# Altium project 9-10-00224-1_REV02_062018.PrjPcb
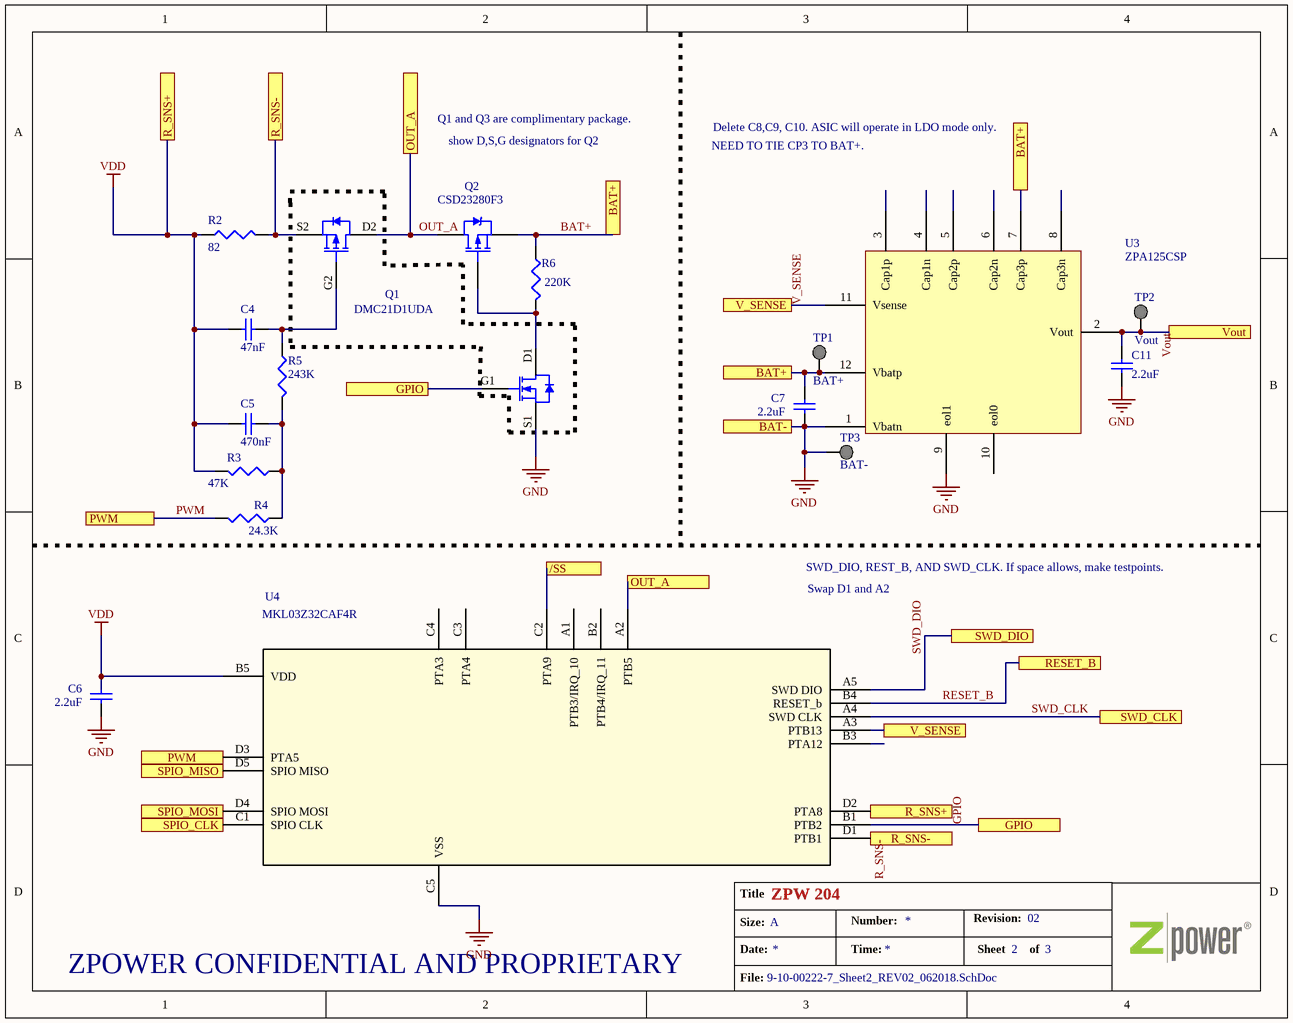
[diagram p0: 9-10-00222-7_Sheet2_REV02_062018.SchDoc]
2 sheets, 17 parts. Net scope: flat (ports and power ports of the same name join across sheets).
Board file: 9-10-00203-3_REV02_062018.PcbDoc
Sheets:
  9-10-00222-7_Sheet2_REV02_062018.SchDoc
  9-10-00222-7_Sheet3_REV02_062018.SchDoc

## Sheet 9-10-00222-7_Sheet2_REV02_062018.SchDoc: ZPW 204
size A; Revision: 02; SheetNumber: 2; SheetTotal: 3

### Parts
C4  47nF  [CAPC0603X03L(0201)]
C5  470nF  [CAPC0603X03L(0201)]
C6  2.2uF  [CAPC0603X03L(0201)]
C7  2.2uF  [CAPC0603X03L(0201)]
C11  2.2uF  [CAPC0603X03L(0201)]
Q1  DMC21D1UDA  [DMC21D1UDA]
Q2  CSD23280F3  [CSD23280F3]
R2  82  [RES0603X03L(0201)]
R3  47K  [RES0603X03L(0201)]
R4  24.3K  [RES0603X03L(0201)]
R5  243K  [RES0603X03L(0201)]
R6  220K  [RES0603X03L(0201)]
TP1  BAT+  [PAD 1.5MM X 0.5MM]
TP2  Vout  [PAD 1.5MM X 0.5MM]
TP3  BAT-  [BAT-]
U3  ZPA125CSP  [BGA12C30P4X4_138X138X38]
U4  MKL03Z32CAF4R  [MKL03Z32CBF4R]

### Ports
/SS, BAT+, BAT-, GPIO, OUT_A, PWM, R_SNS+, R_SNS-, RESET_B, SPIO_CLK, SPIO_MISO, SPIO_MOSI, SWD_CLK, SWD_DIO, V_SENSE, Vout

### Nets
GND: C6.1 C7.1 C11.1 Q1.S1 TP3.1(TP) U3.1(Vbatn) U3.9(eol1) U4.C5(VSS) ; port BAT-
VDD: C4.2 C5.1 C6.2 R2.1 R3.2 U4.B5(VDD) U4.D2(PTA8) ; port R_SNS+
BAT+: C7.2 Q2.2(S) R6.1 TP1.1(TP) U3.7(Cap3p) U3.12(Vbatp) ; port BAT+
GPIO: Q1.G1 U4.B1(PTB2) ; port GPIO
OUT_A: Q1.D2 Q2.3(D) U4.A2(PTB5) ; port OUT_A
PWM: R4.2 U4.D3(PTA5) ; port PWM
R_SNS-: Q1.S2 R2.2 U4.D1(PTB1) ; port R_SNS-
RESET_B: U4.B4(RESET_b) ; port RESET_B
SWD_CLK: U4.A4(SWD_CLK) ; port SWD_CLK
SWD_DIO: U4.A5(SWD_DIO) ; port SWD_DIO
V_SENSE: U3.11(Vsense) U4.A3(PTB13) ; port V_SENSE
Vout: C11.2 TP2.1(TP) U3.2(Vout) ; port Vout
NetC4_1: C4.1 Q1.G2 R5.1
NetC5_2: C5.2 R3.1 R4.1 R5.2
NetQ1_D1: Q1.D1 Q2.1(G) R6.2
NetU4_C1: U4.C1(SPIO_CLK) ; port SPIO_CLK
NetU4_C2: U4.C2(PTA9) ; port /SS
NetU4_D4: U4.D4(SPIO_MOSI) ; port SPIO_MOSI
NetU4_D5: U4.D5(SPIO_MISO) ; port SPIO_MISO

Not connected (* = marked no-connect by the designer): U3 3(Cap1p) 4(Cap1n) 5(Cap2p) 6(Cap2n) 8(Cap3n) 10(eol0); U4 A1(PTB3/IRQ_10) B2(PTB4/IRQ_11) B3(PTA12) C3(PTA4) C4(PTA3)

### Notes on the sheet
- Q1 and Q3 are complimentary package.
- show D,S,G designators for Q2
- NEED TO TIE CP3 TO BAT+.
- Delete C8,C9, C10. ASIC will operate in LDO mode only.
- SWD_DIO, REST_B, AND SWD_CLK. If space allows, make testpoints.
- (near U4) Swap D1 and A2
- Title
- ZPOWER CONFIDENTIAL AND PROPRIETARY
- Size:
- Date:
- A
- Number:
- Time:
- Revision:
- Sheet        of
- File:

### Library data of the parts
C4 = Cap Semi: CAP CER 0.047UF 16V X5R 0201; Manufacturer Part Number: GRM033R61C473KE84D; Tolerance: 20%; CM BOM: X; Published: 8-Jun-2000; LatestRevisionDate: 29-May-2009; LatestRevisionNote: IPC-7351 Footprint Added.; PackageReference: 0201; Publisher: Altium Limited; PackageDescription: Chip Capacitor; Value: 47nF; Supplier1: DigiKey; Supplier1 Part Number: 490-7227-2-ND; Type: CAP; Package: 0201; Voltage Rating: 16V
C5 = Cap Semi: CAP CER 0.47UF 4V X5R 0201; Manufacturer Part Number: GRM033R60G474ME90D; Tolerance: 20%; CM BOM: X; Published: 8-Jun-2000; LatestRevisionDate: 29-May-2009; LatestRevisionNote: IPC-7351 Footprint Added.; Publisher: Altium Limited; PackageDescription: Chip Capacitor; Value: 470nF; Supplier1: DigiKey; Supplier1 Part Number: 490-10405-2-ND; Package: 0201; Type: CAP; Voltage Rating: 4V
C6 C7 C11 = Cap Semi: CAP CER 2.2UF 6.3V X5R 0201; Manufacturer Part Number: GRM033R60J225ME47D; Manufacturer: Murata; Tolerance: 20%; CM BOM: X; Published: 8-Jun-2000; LatestRevisionDate: 29-May-2009; LatestRevisionNote: IPC-7351 Footprint Added.; Publisher: Altium Limited; PackageDescription: Chip Capacitor, 0603; Value: 2.2uF; Supplier1 Part Number: 490-13225-2-ND; Supplier1: Digi-Key; Package: 0201; Type: CAP; Voltage Rating: 6.3V
Q1 = DMC21D1UDA: COMPLEMENTARY PAIR ENHANCEMENT MODE MOSFET; Manufacturer Part Number: DMC21D1UDA
Q2 = DMP2160UW: MOSFET P-CH -12V; CM BOM: X; Supplier1: Digi-Key; Manufacturer Part Number: CSD23280F3; Type: MOSFET
R2 = Res3: RES SMD 100 OHM 0.1% 1/20W 0201; Manufacturer Part Number: RR0306P-820-D; Tolerance: 0.5%; CM BOM: X; PackageDescription: Chip Resistor; Value: 82; Supplier1 Part Number: RR03P82DCT-ND; Type: RES; Power Rating: 1/20W; Package: 0201
R3 = Res3: RES SMD 47K OHM 1% 1/20W 0201; Manufacturer Part Number: RC0201FR-0747KL; Power Rating: 1/10W; CM BOM: X; PackageDescription: Chip Resistor; Value: 47K; Supplier1: DigiKey; Supplier1 Part Number: 311-47KMCT-ND; Tolerance: 1%; Package: 0201; Type: RES
R4 = Res3: RES SMD 24.3K OHM 1% 1/20W 0201; Manufacturer Part Number: ERJ-1GEF2432C; CM BOM: X; Published: 8-Jun-2000; LatestRevisionDate: 29-May-2009; LatestRevisionNote: IPC-7351 Footprint Added.; Publisher: Altium Limited; PackageDescription: Chip Resistor; Value: 24.3K; Supplier1: DigiKey; Supplier1 Part Number: P24.3KABTR-ND; Tolerance: 1%; Power Rating: 1/20W; Package: 0201; Type: RES
R5 = Res3: RES SMD 243K OHM 1% 1/20W 0201; Manufacturer Part Number: RMCF0201FT243K; CM BOM: X; Published: 8-Jun-2000; LatestRevisionDate: 29-May-2009; LatestRevisionNote: IPC-7351 Footprint Added.; Publisher: Altium Limited; PackageDescription: Chip Resistor; Value: 243K; Supplier1: DigiKey; Supplier1 Part Number: RMCF0201FT243KTR-ND; Tolerance: 1%; Package: 0201; Power Rating: 1/20W; Type: RES
R6 = Res3: RES SMD 220K OHM 1% 1/20W 0201; Manufacturer Part Number: RC0201FR-07220KL; CM BOM: X; Published: 8-Jun-2000; LatestRevisionDate: 29-May-2009; LatestRevisionNote: IPC-7351 Footprint Added.; Publisher: Altium Limited; PackageDescription: Chip Resistor; Value: 220K; Supplier1: DigiKey; Supplier1 Part Number: YAG2277CT-ND; Tolerance: 1%; Type: RES; Package: 0201; Power Rating: 1/20W
TP2 TP3 = BAT+
U3 = ZPA125CSP: CM BOM: X; Supplier1 Part Number: ZPA125 R2; Supplier1: ZPower
U4 = MKL03Z32CBF4R_1: Kinetis Kl03: 48MHz Cortex-M0+ Ultra low power MCU; Vendor: FREESCALE; CM BOM: X; Manufacturer Part Number: MKL03Z32CBF4R; Value: Value; Supplier1 Part Number: MKL03Z32CBF4R-ND; Supplier1: Digi-Key

## Sheet 9-10-00222-7_Sheet3_REV02_062018.SchDoc: ZPW 204
size A; Revision: 02; SheetNumber: 3; SheetTotal: 3
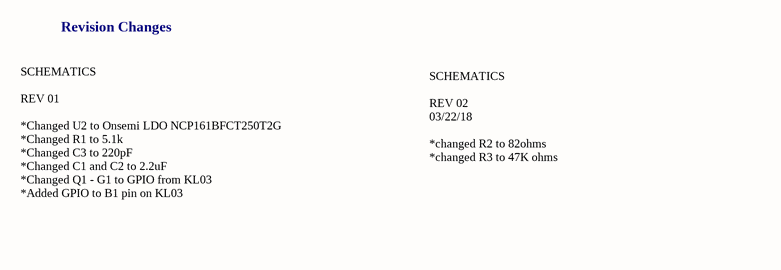
[diagram p1: 9-10-00222-7_Sheet3_REV02_062018.SchDoc]

### Notes on the sheet
- Revision Changes
- SCHEMATICS
  REV 01
  *Changed U2 to Onsemi LDO NCP161BFCT250T2G
  *Changed R1 to 5.1k
  *Changed C3 to 220pF
  *Changed C1 and C2 to 2.2uF
  *Changed Q1 - G1 to GPIO from KL03
  *Added GPIO to B1 pin on KL03
- SCHEMATICS
  REV 02
  03/22/18
  *changed R2 to 82ohms
  *changed R3 to 47K ohms
- Title
- ZPOWER CONFIDENTIAL AND PROPRIETARY
- Size:
- Date:
- A
- Number:
- Time:
- Revision:
- Sheet        of
- File: